# EAGLE design inner-supply (EAGLE 5.07)
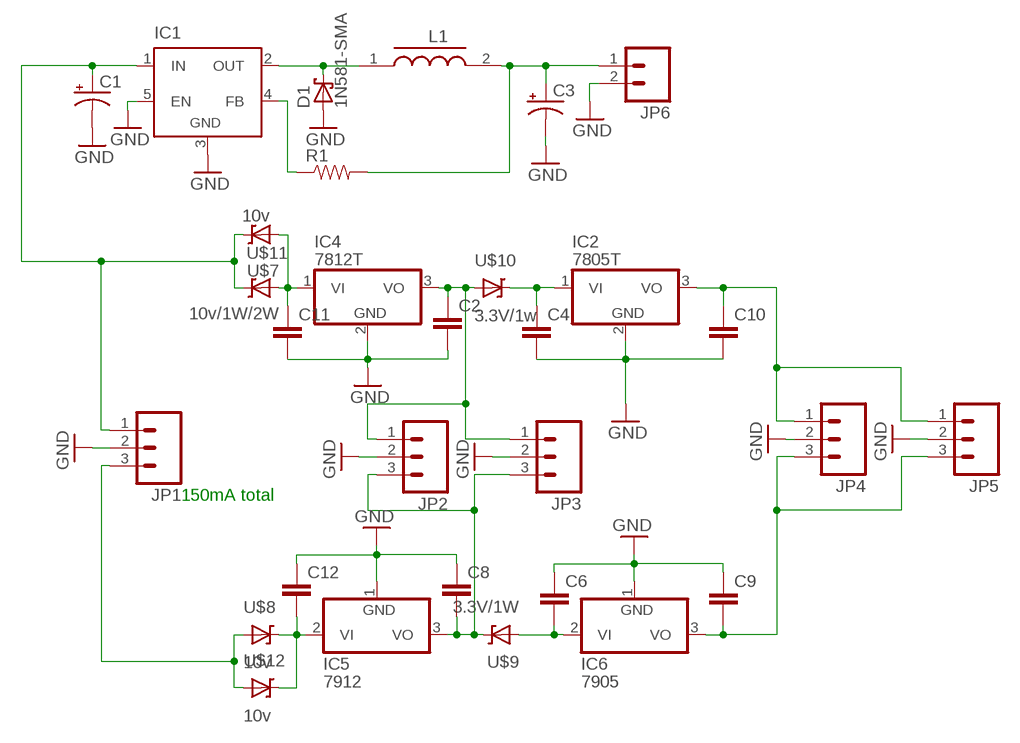
[diagram p0: schematic, sheet 1]

## Parts
C1  CAP_POLPTH1  [CPOL-RADIAL-100UF-25V]
C2  CAP-C1206  [C1206]
C3  CAP_POLPTH1  [CPOL-RADIAL-100UF-25V]
C4  CAP-C1206  [C1206]
C6  CAP-C1206  [C1206]
C8  CAP-C1206  [C1206]
C9  CAP-C1206  [C1206]
C10  CAP-C1206  [C1206]
C11  CAP-C1206  [C1206]
C12  CAP-C1206  [C1206]
D1  1N581-SMA  [SMA-DIODE]
IC1  LM2596TH  [TO220-52]
IC2  7805T  [TO220H]
IC4  7812T  [TO220H]
IC5  7912  7912T  [TO220H]
IC6  7905  7905T  [TO220H]
JP1  M03POLAR  [MOLEX-1X3]
JP2  M03POLAR  [MOLEX-1X3]
JP3  M03POLAR  [MOLEX-1X3]
JP4  M03POLAR  [MOLEX-1X3]
JP5  M03POLAR  [MOLEX-1X3]
JP6  CON-02-XH  [XH-1X2-LONG-LOCK]
L1  INDUCTOR-I-CDRH125  [CDRH125]
R1  RESISTOR1/4W  [AXIAL-0.3]
U$7  10v/1W/2W  DIODE-ZENERPTH  [DIODE-ZENER]
U$8  10v  DIODE-ZENERPTH  [DIODE-ZENER]
U$9  3.3V/1W  DIODE-ZENERPTH  [DIODE-ZENER]
U$10  3.3V/1w  DIODE-ZENERPTH  [DIODE-ZENER]
U$11  10v  DIODE-ZENERPTH  [DIODE-ZENER]
U$12  10v  DIODE-ZENERPTH  [DIODE-ZENER]

## Nets
GND: C1.2(-) C2.2 C3.2(-) C4.2 C6.1 C8.1 C9.1 C10.2 C11.2 C12.1 D1.A IC1.3(GND) IC1.5(EN) IC2.2(GND) IC4.2(GND) IC5.1(GND) IC6.1(GND) JP1.2 JP2.2 JP3.2 JP4.2 JP5.2 JP6.2
N$1: C10.1 IC2.3(VO) JP4.1 JP5.1
N$2: C9.2 IC6.3(VO) JP4.3 JP5.3
N$4: JP1.3 U$8.P$2(A) U$12.P$2(A)
N$5: D1.C IC1.2(OUT) L1.1
N$6: C4.1 IC2.1(VI) U$10.P$1(C)
N$7: C3.1(+) JP6.1 L1.2 R1.P$2
N$8: C1.1(+) IC1.1(IN) JP1.1 U$7.P$1(C) U$11.P$1(C)
N$9: C11.1 IC4.1(VI) U$7.P$2(A) U$11.P$2(A)
N$10: C12.2 IC5.2(VI) U$8.P$1(C) U$12.P$1(C)
N$11: IC1.4(FB) R1.P$1
N$20: C8.2 IC5.3(VO) JP2.3 JP3.3 U$9.P$1(C)
N$23: C2.1 IC4.3(VO) JP2.1 JP3.1 U$10.P$2(A)
N$27: C6.2 IC6.2(VI) U$9.P$2(A)

## Notes on the sheet
- 150mA total

## Library data of the parts
C1 C3 = digital-toy:CAP_POL: Capacitor Polarized These are standard SMD and PTH capacitors. Normally 10uF, 47uF, and 100uF in electrolytic and tantalum varieties. Always verify the external diameter of the through hole cap, it varies with capacity, voltage, and manufacturer. The EIA devices should be standard. PANASONIC_D size: 6.5mmx6.5mmx5.5mm, 100uf (taobao:6.3mmx5.5mm), same as CVL0605 153cvl0405 size: 4mmx4mmx5.5mm, 10uf (taobao:4mmx5.5mm) ct6032 typical 47uF Tantalum, comment by hyl.
C2 C4 C6 C8-C12 = digital-toy:CAP: Capacitor Standard 0603 ceramic capacitor, and 0.1" leaded capacitor.
D1 = digital-toy:1N581*: 1.0A SCHOTTKY BARRIER RECTIFIER Source: http://www.diodes.com/datasheets/ds23001.pdf
IC1 = linear:LM2596T: STEP-DOWN VOLTAGE REGULATOR
IC2 IC4 = linear:78*: Positive VOLTAGE REGULATOR Source: http://cache.national.com/ds/LM/LM78L05.pdf http://www.fairchildsemi.com/ds/LM/LM7805.pdf
IC5 IC6 = linear:79*: Negative VOLTAGE REGULATOR
JP1-JP5 = digital-toy:M03: Header 3 Standard 3-pin 0.1" header. Use with straight break away headers (SKU : PRT-00116), right angle break away headers (PRT-00553), swiss pins (PRT-00743), machine pins (PRT-00117), and female headers (PRT-00115). Molex polarized connector foot print use with SKU : PRT-08232 with associated crimp pins and housings.
JP6 = digital-toy:CON-02: Header 2 Standard 2-pin 0.1" header. Use with straight break away headers (SKU : PRT-00116), right angle break away headers (PRT-00553), swiss pins (PRT-00743), machine pins (PRT-00117), and female headers (PRT-00115). Molex polarized connector foot print use with SKU : PRT-08233 with associated crimp pins and housings.
L1 = digital-toy:INDUCTOR-I: Inductors with Iron
R1 = digital-toy:RESISTOR: Resistor Basic schematic elements and footprints for 0603, 1206, and PTH 1/10th watt (small) resistors. digital-toy copy vertical mount of axial-0.3 from rcl.lbr : the 0207/xx
U$7-U$12 = digital-toy:DIODE-ZENER: Zener Diode Production Part - 8199 3.4V Zener Voltage

## Board
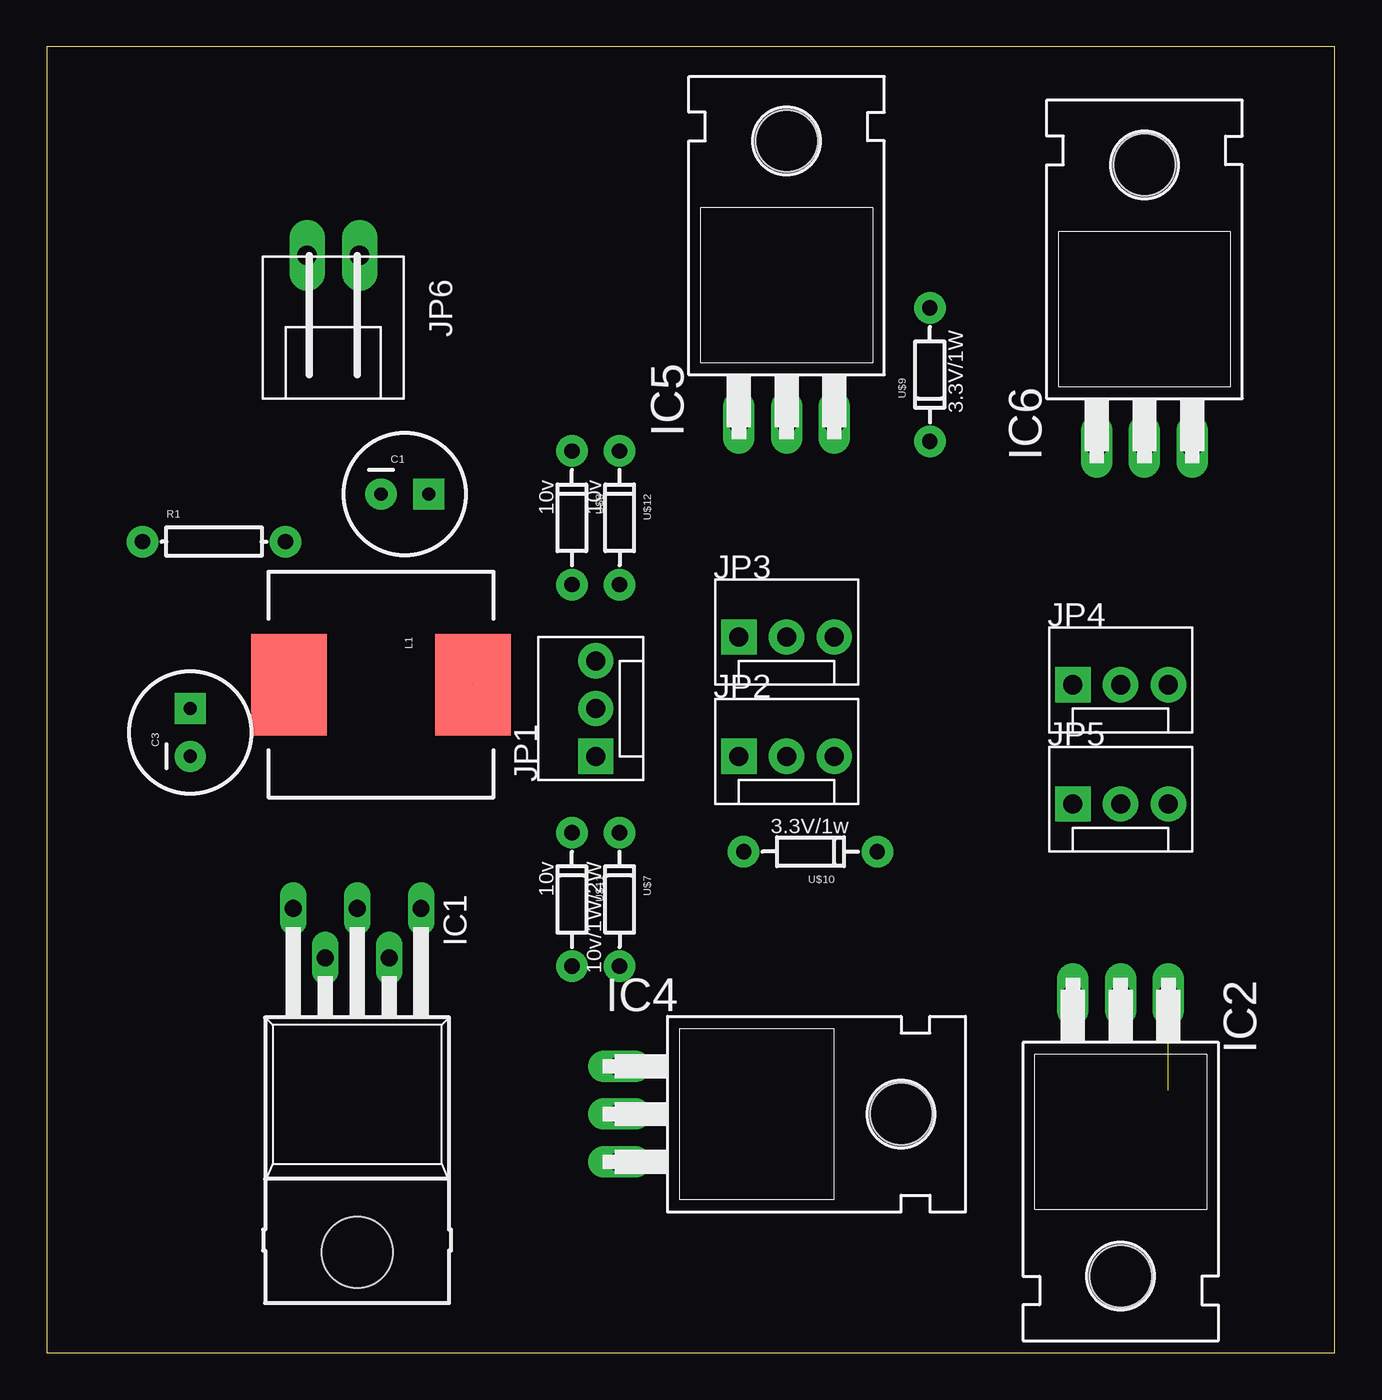
[diagram p1: board, top side]
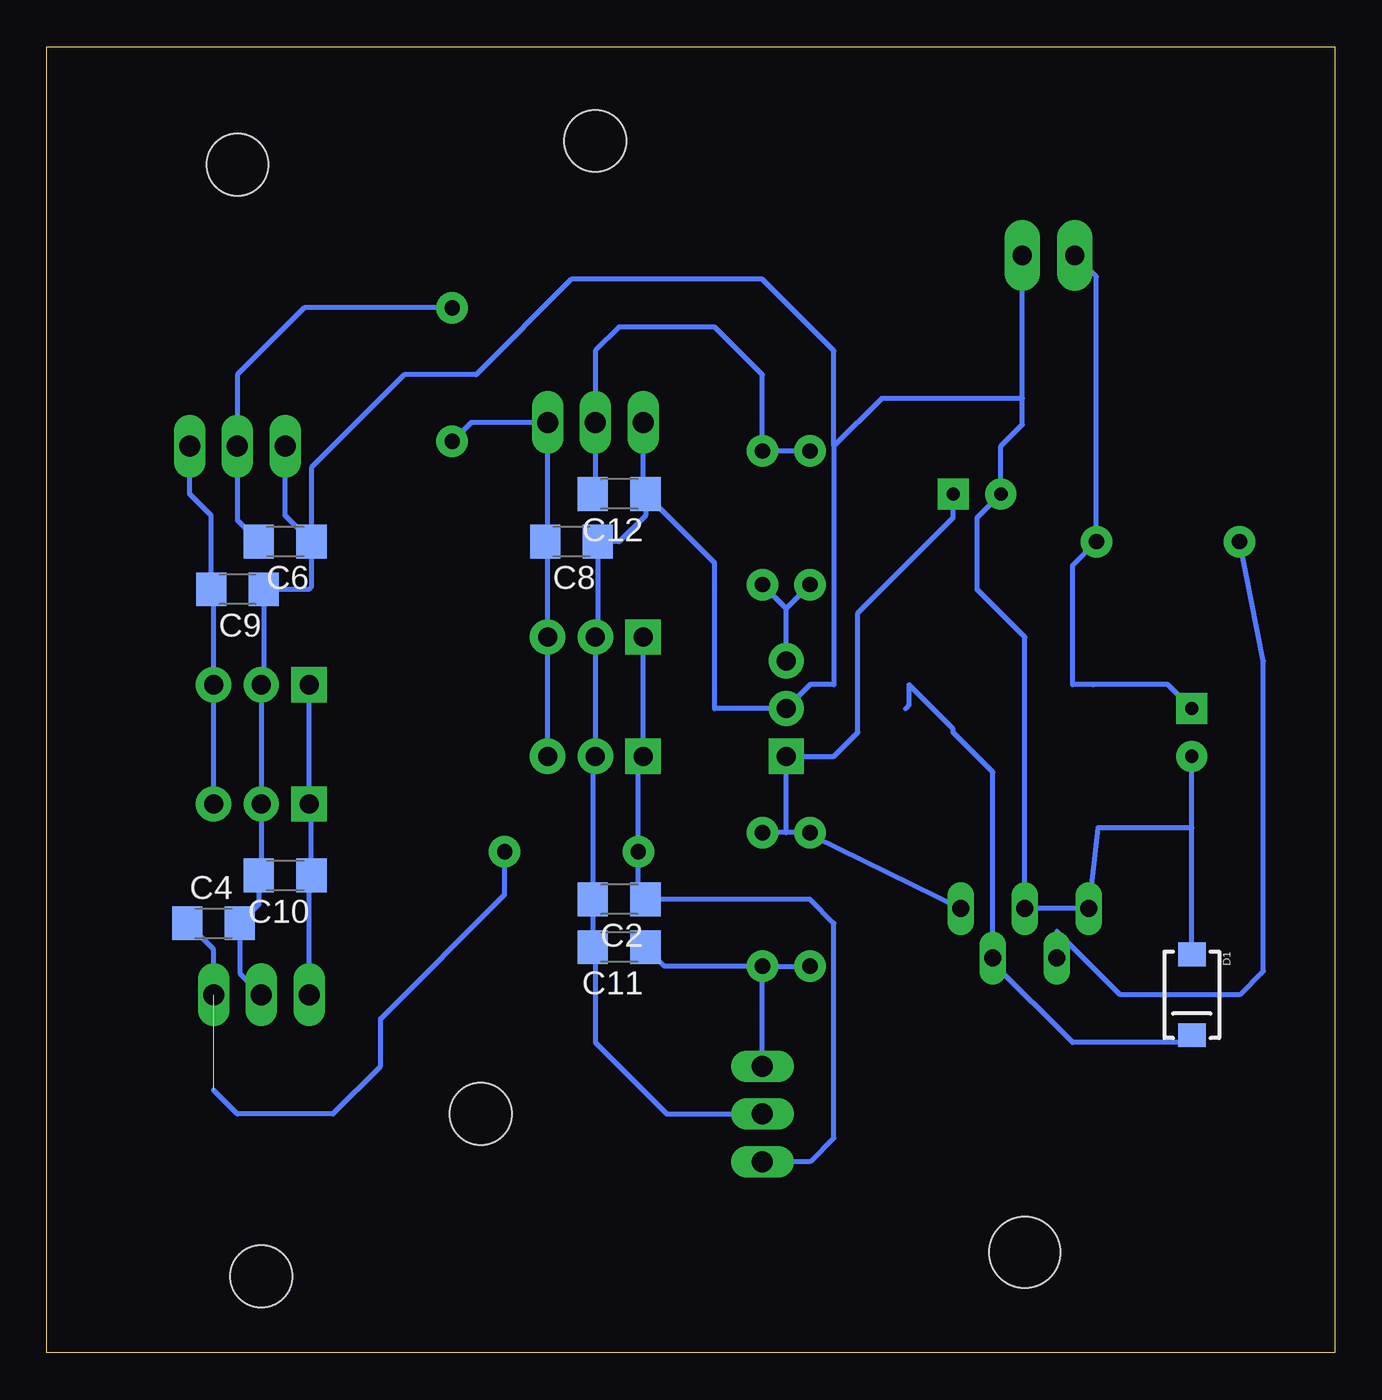
[diagram p2: board, bottom side, seen from below]

Size 68.56 x 69.52 mm. Coordinates in mm from the lower left corner, seen from the top.
Outline: 0,0 68.56,0 68.56,69.52 0,69.52 0,0
Copper layers (1*16): Top 0.035mm / dielectric 1.5mm / Bottom 0.035mm
Design rules "default": minimum track width 10mil, minimum drill 24mil, track to track 8mil, track to pad 8mil, pad to pad 8mil, via to via 8mil, smd to smd 8mil, copper to edge 40mil, drill to drill 8mil, minimum pad ring 10mil, minimum via ring 8mil, stop-mask expansion 4mil, vias tented up to drill 0mil, thermal gap 10mil

### Footprints (pad centres in the part's own frame; a part is rotated, then mirrored left to right if it is on the bottom)
CPOL-RADIAL-100UF-25V = drill 0.7 pad 1.651 square: 1 1.27,0 | drill 0.7 pad 1.651 round: 2 -1.27,0
C1206 = smd 1.6 x 1.8: 1 -1.4,0; 2 1.4,0
SMA-DIODE = smd 1.27 x 1.47: A -2.15,0; C 2.15,0
TO220-52 = drill 0.9 long: 1 -3.4,-21.1; 2 -1.7,-18.47; 3 0,-21.1; 4 1.7,-18.47; 5 3.4,-21.1 | hole 3.8: 0,-2.8
TO220H = drill 1.118 long: 1 -2.54,-10.16; 2 0,-10.16; 3 2.54,-10.16 | hole 3.302: 0,4.826
MOLEX-1X3 = drill 1.016 pad 1.88 square: 1 0,0 | drill 1.016 pad 1.88 round: 2 2.54,0; 3 5.08,0
XH-1X2-LONG-LOCK = drill 1.016 pad 1.88 long: 1 1.397,0; 2 -1.397,0
CDRH125 = smd 5.4 x 4: 1 0,4.9; 2 0,-4.9
AXIAL-0.3 = drill 0.813 pad 1.676 round: P$1 -3.81,0; P$2 3.81,0
DIODE-ZENER = drill 0.813 pad 1.676 round: P$1 -3.556,0; P$2 3.556,0

### Placement (x,y rotation side)
C1  19.05,45.72 0 top
C2  38.1,24.13 180 bottom
C3  7.62,33.02 90 top
C4  59.69,22.86 0 bottom
C6  55.88,43.18 180 bottom
C8  40.64,43.18 180 bottom
C9  58.42,40.64 180 bottom
C10  55.88,25.4 180 bottom
C11  38.1,21.59 180 bottom
C12  38.1,45.72 180 bottom
D1  7.62,19.05 270 bottom
IC1  16.51,2.54 180 top
IC2  57.15,8.89 180 top
IC4  40.64,12.7 270 top
IC5  39.37,59.69 0 top
IC6  58.42,58.42 0 top
JP1  29.21,31.75 90 top
JP2  36.83,31.75 0 top
JP3  36.83,38.1 0 top
JP4  54.61,35.56 0 top
JP5  54.61,29.21 0 top
JP6  15.24,58.42 180 top
L1  17.78,35.56 270 top
R1  8.89,43.18 0 top
U$7  30.48,24.13 270 top
U$8  27.94,44.45 270 top
U$9  46.99,52.07 90 top
U$10  40.64,26.67 180 top
U$11  27.94,24.13 270 top
U$12  30.48,44.45 270 top

### Tracks (layer width: path | path; a pad name or v marks a point on that pad's centre or on a via)
GND
  Bottom 0.254: C12.1 33.02,42.04 33.02,34.29 JP1.2 27.94,35.56 26.67,35.56 26.67,48.26 | IC4.2 35.56,12.7 39.37,16.51 39.37,21.46 C11.2 C2.2 39.5,31.62 JP2.2 JP3.2 39.24,38.23 C8.1 38.1,43.18 36.7,44.58 C12.1 | IC5.1 36.83,45.85 C12.1 | IC6.1 55.88,44.58 C6.1 | C6.1 54.48,40.77 54.61,40.64 C9.1 57.02,35.69 JP4.2 JP5.2 57.15,25.53 C10.2 57.28,23.87 C4.2 58.29,20.19 IC2.2 | C6.1 54.48,47.12 49.53,52.07 45.72,52.07 40.64,57.15 30.48,57.15 26.67,53.34 26.67,48.26 | D1.A 7.62,27.94 | 7.62,27.94 12.62,27.94 IC1.5 IC1.3 16.51,38.1 19.05,40.64 19.05,44.45 C1.2 17.78,48.26 16.64,49.4 16.64,50.8 | 7.62,27.94 C3.2 | 16.64,50.8 JP6.2 | 26.67,48.26 24.13,50.8 16.64,50.8
N$1
  Bottom 0.254: IC2.3 54.61,25.27 C10.1 54.48,29.08 JP5.1 JP4.1
N$2
  Bottom 0.254: IC6.3 60.96,45.72 59.82,44.58 C9.2 59.69,40.51 JP4.3 JP5.3
N$4
  Bottom 0.254: JP1.3 29.21,39.62 | 29.21,39.62 U$8.P$2 | 29.21,39.62 U$12.P$2
N$5  (1 unrouted)
  Bottom 0.254: D1.C 8.01,16.51 13.97,16.51 18.21,20.75 IC1.2 18.21,30.91 20.32,33.02 20.32,33.2 L1.1 22.68,34.47 22.86,34.29
N$6  (1 unrouted)
  Bottom 0.254: U$10.P$1 44.2,24.38 50.8,17.78 50.8,15.24 53.34,12.7 58.42,12.7 59.69,13.97 | IC2.1 59.69,21.46 C4.1
N$7  (1 unrouted)
  Bottom 0.254: C3.1 8.89,35.56 L1.2 13.97,35.56 13.97,41.91 R1.P$2 12.7,57.28 JP6.1
N$8
  Bottom 0.254: 29.21,27.69 U$11.P$1 27.7,27.45 IC1.1 | 29.21,27.69 U$7.P$1 | 29.21,27.69 JP1.1 26.67,31.75 25.4,33.02 25.4,39.37 20.32,44.45 C1.1
N$9
  Bottom 0.254: IC4.1 U$7.P$2 | U$7.P$2 U$11.P$2 | U$7.P$2 35.68,20.57 C11.1
N$10
  Bottom 0.254: U$8.P$1 U$12.P$1 30.48,52.07 33.02,54.61 38.1,54.61 39.37,53.34 IC5.2 39.37,45.85 C12.2
N$11
  Bottom 0.254: IC1.4 14.81,22.43 11.43,19.05 5.08,19.05 3.81,20.32 3.81,36.83 R1.P$1
N$20
  Bottom 0.254: JP2.3 JP3.3 41.91,43.05 C8.2 41.91,43.31 IC5.3 45.97,49.53 U$9.P$1
N$23
  Bottom 0.254: IC4.3 27.94,10.16 26.67,11.43 26.67,22.86 27.94,24.13 C2.1 37.08,24.51 U$10.P$2 37.08,31.5 JP2.1 JP3.1
N$27
  Bottom 0.254: U$9.P$2 54.86,55.63 58.42,52.07 IC6.2 58.42,44.32 C6.2